# EAGLE schematic controller_board (EAGLE 9.3.0)
Assembly variants: Minimal, FullAwesome
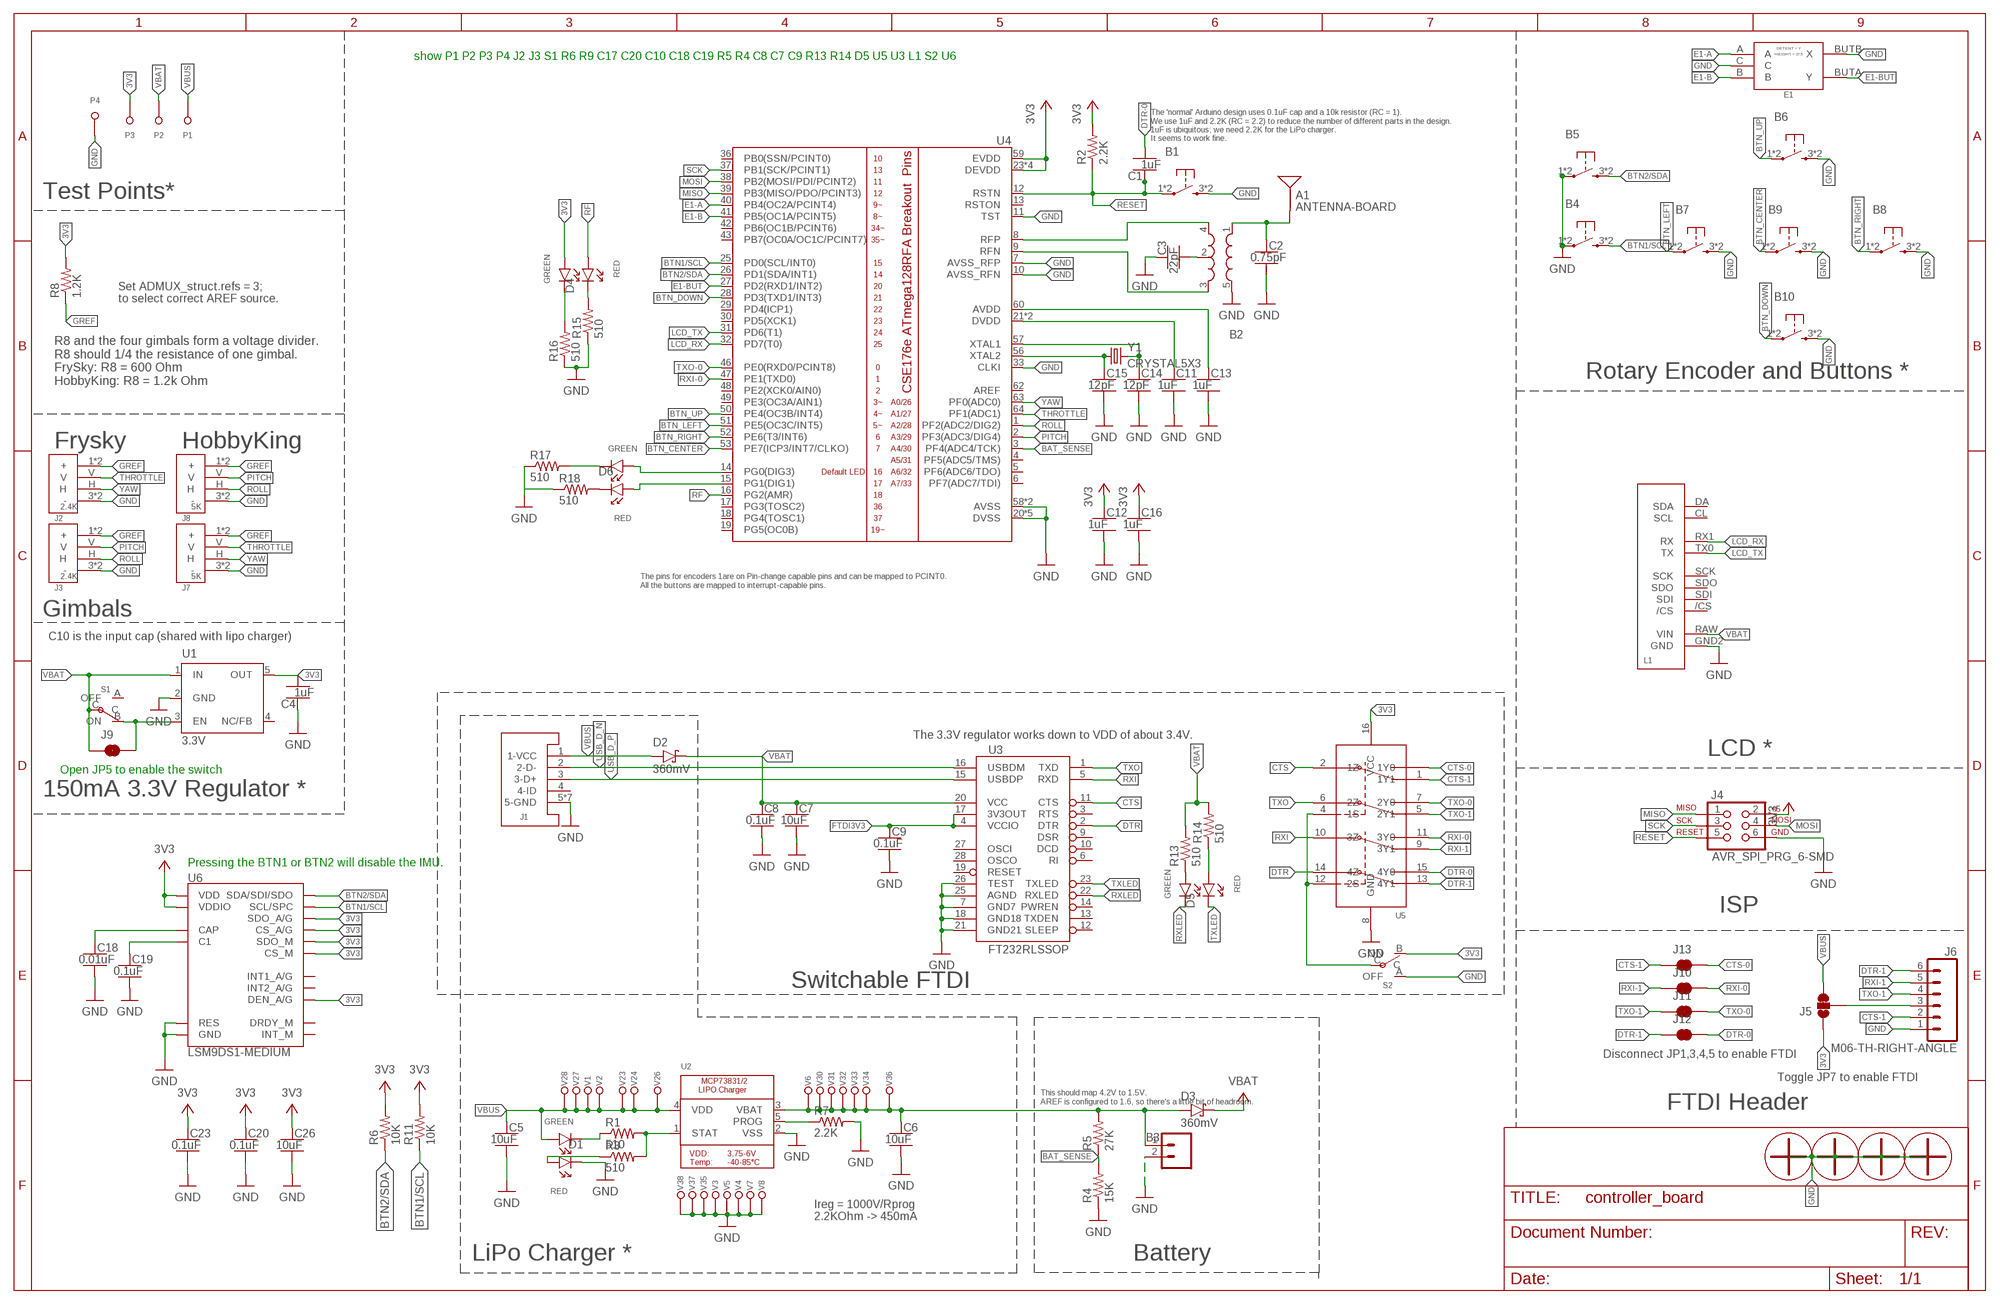
[diagram p0: schematic, sheet 1]
FRAME1 (FRAME_B_L): CREATOR: Unknown; DIST: Unknown; DISTPN: Unknown

## Parts
A1  ANTENNA-BOARD  [ANT_PCB_2.4GHZ_NRF8001_1.6MM_1OZ]
B1  PUSHBUTTON_-4.5X4.5  [4.5MM_TACTILE_SWITCH_TL3305AF160QG]
B2  BALUN0805  [BALUN]
B3  HEADER-0.1IN-2POS-SCREW  [SCREW-TERMINAL-1X2-2.54MM]
B4  PUSHBUTTON_-4.5X4.5  [4.5MM_TACTILE_SWITCH_TL3305AF160QG]  (not fitted in variant Minimal)
B5  PUSHBUTTON_-4.5X4.5  [4.5MM_TACTILE_SWITCH_TL3305AF160QG]  (not fitted in variant Minimal)
B6  PUSHBUTTON_-4.5X4.5  [4.5MM_TACTILE_SWITCH_TL3305AF160QG]
B7  PUSHBUTTON_-4.5X4.5  [4.5MM_TACTILE_SWITCH_TL3305AF160QG]
B8  PUSHBUTTON_-4.5X4.5  [4.5MM_TACTILE_SWITCH_TL3305AF160QG]
B9  PUSHBUTTON_-4.5X4.5  [4.5MM_TACTILE_SWITCH_TL3305AF160QG]
B10  PUSHBUTTON_-4.5X4.5  [4.5MM_TACTILE_SWITCH_TL3305AF160QG]
C1  1uF  CAPACITOR-NP_SMD-2012-0805_CERAMIC-1UF  [CAPC2012X140_HS]
C2  0.75pF  CAPACITOR-NP_SMD-2012-0805_CERAMIC-0.75PF  [CAPC2012X140_HS]
C3  22pF  CAPACITOR-NP_SMD-2012-0805_CERAMIC-22PF  [CAPC2012X140_HS]
C4  1uF  CAPACITOR-NP_SMD-2012-0805_CERAMIC-1UF  [CAPC2012X140_HS]
C5  10uF  CAPACITOR-NP_SMD-2012-0805_CERAMIC-10UF  [CAPC2012X140_HS]
C6  10uF  CAPACITOR-NP_SMD-2012-0805_CERAMIC-10UF  [CAPC2012X140_HS]
C7  10uF  CAPACITOR-NP_SMD-2012-0805_CERAMIC-10UF  [CAPC2012X140_HS]  (not fitted in variant Minimal)
C8  0.1uF  CAPACITOR-NP_SMD-2012-0805_CERAMIC-0.1UF  [CAPC2012X140_HS]  (not fitted in variant Minimal)
C9  0.1uF  CAPACITOR-NP_SMD-2012-0805_CERAMIC-0.1UF  [CAPC2012X140_HS]  (not fitted in variant Minimal)
C11  1uF  CAPACITOR-NP_SMD-2012-0805_CERAMIC-1UF  [CAPC2012X140_HS]
C12  1uF  CAPACITOR-NP_SMD-2012-0805_CERAMIC-1UF  [CAPC2012X140_HS]
C13  1uF  CAPACITOR-NP_SMD-2012-0805_CERAMIC-1UF  [CAPC2012X140_HS]
C14  12pF  CAPACITOR-NP_SMD-2012-0805_CERAMIC-12PF  [CAPC2012X140_HS]
C15  12pF  CAPACITOR-NP_SMD-2012-0805_CERAMIC-12PF  [CAPC2012X140_HS]
C16  1uF  CAPACITOR-NP_SMD-2012-0805_CERAMIC-1UF  [CAPC2012X140_HS]
C18  0.01uF  CAPACITOR-NP_SMD-2012-0805_CERAMIC-0.01UF  [CAPC2012X140_HS]
C19  0.1uF  CAPACITOR-NP_SMD-2012-0805_CERAMIC-0.1UF  [CAPC2012X140_HS]
C20  0.1uF  CAPACITOR-NP_SMD-2012-0805_CERAMIC-0.1UF  [CAPC2012X140_HS]
C23  0.1uF  CAPACITOR-NP_SMD-2012-0805_CERAMIC-0.1UF  [CAPC2012X140_HS]
C26  10uF  CAPACITOR-NP_SMD-2012-0805_CERAMIC-10UF  [CAPC2012X140_HS]
D1  LED-2X-GREEN/RED  [LED-2X-LTST-C155]
D2  360mV  DIODE-SCHOTTKY_SMD-SOD123-360MV  [SOD3716X135_HS]
D3  360mV  DIODE-SCHOTTKY_SMD-SOD123-360MV  [SOD3716X135_HS]
D4  LED-2X-GREEN/RED  [LED-2X-LTST-C155]
D5  LED-2X-GREEN/RED  [LED-2X-LTST-C155]  (not fitted in variant Minimal)
D6  LED-2X-GREEN/RED  [LED-2X-LTST-C155]
E1  ROTARY-ENCODER-W/BUTTON-BOURNS-PEC12R-4217F  [BOURNS-PEC12R]
H1  MOUNTING-HOLE-2-56-GROUNDED  [2-56-MOUNTING-HOLE]
H2  MOUNTING-HOLE-2-56-GROUNDED  [2-56-MOUNTING-HOLE]
H3  MOUNTING-HOLE-2-56-GROUNDED  [2-56-MOUNTING-HOLE]
H4  MOUNTING-HOLE-2-56-GROUNDED  [2-56-MOUNTING-HOLE]
J1  USB-MICROA-AMPHENOL-10118192-0001LF  [USB-MICROA-10118192-0001LF]  (not fitted in variant Minimal)
J2  2.4K  FRSKY-GIMBAL-FRYSKY  [JST-13-PTH]  (not fitted in variant Minimal)
J3  2.4K  FRSKY-GIMBAL-FRYSKY  [JST-13-PTH]  (not fitted in variant Minimal)
J4  AVR_SPI_PRG_6-SMD  [2X3-SMD]
J5  JUMPER-SMT_3_1-NC_TRACE_NO-SILK  [SMT-JUMPER_3_1-NC_TRACE_NO-SILK]
J6  M06-TH-RIGHT-ANGLE  [1X06-SIP-RIGHT-ANGLE]
J7  5K  FRSKY-GIMBAL-2X-SERVO  [2X-GIMBAL-SERVO]
J8  5K  FRSKY-GIMBAL-2X-SERVO  [2X-GIMBAL-SERVO]
J9  JUMPER-SMT_2_NC_TRACE_NO-SILK  [SMT-JUMPER_2_NC_TRACE_NO-SILK]  (not fitted in variant FullAwesome)
J10  JUMPER-SMT_2_NC_TRACE_NO-SILK  [SMT-JUMPER_2_NC_TRACE_NO-SILK]  (not fitted in variant FullAwesome)
J11  JUMPER-SMT_2_NC_TRACE_NO-SILK  [SMT-JUMPER_2_NC_TRACE_NO-SILK]  (not fitted in variant FullAwesome)
J12  JUMPER-SMT_2_NC_TRACE_NO-SILK  [SMT-JUMPER_2_NC_TRACE_NO-SILK]  (not fitted in variant FullAwesome)
J13  JUMPER-SMT_2_NC_TRACE_NO-SILK  [SMT-JUMPER_2_NC_TRACE_NO-SILK]  (not fitted in variant FullAwesome)
L1  SPARKFUN_SERLCD_SERIAL_REDUCED  [SPARKFUN_SERLCD_16X2_REDUCED]
P1  TEST-POINT  [TEST-POINT-KEYSTONE-5000]  (not fitted in variant Minimal)
P2  TEST-POINT  [TEST-POINT-KEYSTONE-5000]  (not fitted in variant Minimal)
P3  TEST-POINT  [TEST-POINT-KEYSTONE-5000]  (not fitted in variant Minimal)
P4  TEST-POINT  [TEST-POINT-KEYSTONE-5000]  (not fitted in variant Minimal)
R1  510  RESISTOR_SMD-2012-0805-510  [RESC2012X60_HS]
R2  2.2K  RESISTOR_SMD-2012-0805-2.2K  [RESC2012X60_HS]
R3  510  RESISTOR_SMD-2012-0805-510  [RESC2012X60_HS]
R4  15K  RESISTOR_SMD-2012-0805-15K  [RESC2012X60_HS]  (not fitted in variant Minimal)
R5  27K  RESISTOR_SMD-2012-0805-27K  [RESC2012X60_HS]  (not fitted in variant Minimal)
R6  10K  RESISTOR_SMD-2012-0805-10K  [RESC2012X60_HS]
R7  2.2K  RESISTOR_SMD-2012-0805-2.2K  [RESC2012X60_HS]
R8  1.2K  RESISTOR_SMD-2012-0805-1.2K  [RESC2012X60_HS]  (not fitted in variant Minimal)
R11  10K  RESISTOR_SMD-2012-0805-10K  [RESC2012X60_HS]
R13  510  RESISTOR_SMD-2012-0805-510  [RESC2012X60_HS]  (not fitted in variant Minimal)
R14  510  RESISTOR_SMD-2012-0805-510  [RESC2012X60_HS]
R15  510  RESISTOR_SMD-2012-0805-510  [RESC2012X60_HS]
R16  510  RESISTOR_SMD-2012-0805-510  [RESC2012X60_HS]
R17  510  RESISTOR_SMD-2012-0805-510  [RESC2012X60_HS]
R18  510  RESISTOR_SMD-2012-0805-510  [RESC2012X60_HS]
S1  POWER-SWITCH-MFS201N-9-ZJS102011SAQN  [JS102011SAQN]  (not fitted in variant Minimal)
S2  POWER-SWITCH-MFS201N-9-ZJS102011SAQN  [JS102011SAQN]  (not fitted in variant Minimal)
U1  3.3V  TPS73633-DBVT3V3  [SOT23-DBV]
U2  MCP73831T-2ACI/OT  MCP73831/2  [SOT23-5]
U3  FT232RLSSOP  [SSOP28DB]  (not fitted in variant Minimal)
U4  ATMEGA128RFA1  [QFN-64]
U5  DPDT-X2  [SOP65P640X110-16]  (not fitted in variant Minimal)
U6  LSM9DS1-MEDIUM  [NEW_IMU_MEDIUM]
V1  LOCKED-VIA-0.2  [VIA-0.2MM]
V2  LOCKED-VIA-0.2  [VIA-0.2MM]
V3  LOCKED-VIA-0.2  [VIA-0.2MM]
V4  LOCKED-VIA-0.2  [VIA-0.2MM]
V5  LOCKED-VIA-0.2  [VIA-0.2MM]
V6  LOCKED-VIA-0.2  [VIA-0.2MM]
V7  LOCKED-VIA-0.2  [VIA-0.2MM]
V8  LOCKED-VIA-0.2  [VIA-0.2MM]
V23  LOCKED-VIA-0.2  [VIA-0.2MM]
V24  LOCKED-VIA-0.2  [VIA-0.2MM]
V26  LOCKED-VIA-0.2  [VIA-0.2MM]
V27  LOCKED-VIA-0.2  [VIA-0.2MM]
V28  LOCKED-VIA-0.2  [VIA-0.2MM]
V30  LOCKED-VIA-0.2  [VIA-0.2MM]
V31  LOCKED-VIA-0.2  [VIA-0.2MM]
V32  LOCKED-VIA-0.2  [VIA-0.2MM]
V33  LOCKED-VIA-0.2  [VIA-0.2MM]
V34  LOCKED-VIA-0.2  [VIA-0.2MM]
V35  LOCKED-VIA-0.2  [VIA-0.2MM]
V36  LOCKED-VIA-0.2  [VIA-0.2MM]
V37  LOCKED-VIA-0.2  [VIA-0.2MM]
V38  LOCKED-VIA-0.2  [VIA-0.2MM]
Y1  CRYSTAL5X3  [CRYSTAL-SMD-5X3]

## Nets
3V3 [HIGH-I]: C4.2 C12.1 C16.1 C20.1 C23.1 C26.1 D4.A2 J4.2 J5.1 P3.T R2.2 R6.2 R8.2 R11.2 S2.B(ON) U1.5(OUT) U4.23(DEVDD) U4.34(DEVDD) U4.44(DEVDD) U4.54(DEVDD) U4.59(EVDD) U5.16(VCC) U6.CS_A/G U6.CS_M U6.DEN_A/G U6.SDO_A/G U6.SDO_M U6.VDD1(VDD) U6.VDD2(VDD) U6.VDDIO U6.VDDIO2(VDDIO)
ANTENNA [RFSIG]: A1.FEED(SIGNAL) B2.1(IN) C2.1
BAT_SENSE: R4.2 R5.1 U4.3(PF4(ADC4/TCK))
BCAP [HIGH-I]: B2.2(GND) C3.2
BPOS [HIGH-I]: B3.1 C6.1 D3.A R5.2 U2.3(VBAT) V6.P1(N) V30.P1(N) V31.P1(N) V32.P1(N) V33.P1(N) V34.P1(N) V36.P1(N)
BTN1/SCL: B4.3 B4.4 R11.1 U4.25(PD0(SCL/INT0)) U6.SCL/SPC
BTN2/SDA: B5.3 B5.4 R6.1 U4.26(PD1(SDA/INT1)) U6.SDA/SDI/SDO
BTN_CENTER: B9.1 B9.2 U4.53(PE7(ICP3/INT7/CLKO))
BTN_DOWN: B10.1 B10.2 U4.28(PD3(TXD1/INT3))
BTN_LEFT: B7.1 B7.2 U4.51(PE5(OC3C/INT5))
BTN_RIGHT: B8.1 B8.2 U4.52(PE6(T3/INT6))
BTN_UP: B6.1 B6.2 U4.50(PE4(OC3B/INT4))
CLK_NEG: C15.1 U4.56(XTAL2) Y1.1
CLK_POS: C14.1 U4.57(XTAL1) Y1.3
CTS: U3.11(CTS) U5.2(1Z)
CTS-0: J13.2 U5.3(1Y0)
CTS-1: J6.2 J13.1 U5.1(1Y1)
DTR: U3.2(DTR) U5.14(4Z)
DTR-0: C1.2 J12.2 U5.15(4Y0)
DTR-1: J6.6 J12.1 U5.13(4Y1)
E1-A: E1.A U4.40(PB4(OC2A/PCINT4))
E1-B: E1.B U4.41(PB5(OC1A/PCINT5))
E1-BUT: E1.BUTA(Y) U4.27(PD2(RXD1/INT2))
FTDI3V3 [HIGH-I]: C9.1 U3.4(VCCIO) U3.17(3V3OUT)
FTDI_VDD [HIGH-I]: J5.2 J6.3
GND [HIGH-I]: B1.3 B1.4 B2.5(GND) B3.2 B4.1 B4.2 B5.1 B5.2 B6.3 B6.4 B7.3 B7.4 B8.3 B8.4 B9.3 B9.4 B10.3 B10.4 C2.2 C3.1 C4.1 C5.2 C6.2 C7.2 C8.2 C9.2 C11.2 C12.2 C13.2 C14.2 C15.2 C16.2 C18.2 C19.2 C20.2 C23.2 C26.2 D1.C1 E1.BUTB(X) E1.C H1.1(P) H1.2(P) H1.3(P) H1.4(P) H1.5(P) H1.6(P) H1.7(P) H1.8(P) H2.1(P) H2.2(P) H2.3(P) H2.4(P) H2.5(P) H2.6(P) H2.7(P) H2.8(P) H3.1(P) H3.2(P) H3.3(P) H3.4(P) H3.5(P) H3.6(P) H3.7(P) H3.8(P) H4.1(P) H4.2(P) H4.3(P) H4.4(P) H4.5(P) H4.6(P) H4.7(P) H4.8(P) J1.5(5-GND) J1.6(5-GND) J1.7(5-GND) J1.8(5-GND) J1.9(5-GND) J1.10(5-GND) J1.11(5-GND) J2.3(-) J2.6(-) J3.3(-) J3.6(-) J4.6 J6.1 J7.3(-) J7.6(-) J8.3(-) J8.6(-) L1.GND2(GND) P4.T R4.1 R7.2 R15.1 R16.1 R17.1 R18.1 S2.A(OFF) U1.2(GND) U2.2(VSS) U3.7(GND7) U3.18(GND18) U3.21(GND21) U3.25(AGND) U3.26(TEST) U4.7(AVSS_RFP) U4.10(AVSS_RFN) U4.11(TST) U4.20(DVSS) U4.24(DVSS) U4.33(CLKI) U4.35(DVSS) U4.45(DVSS) U4.55(DVSS) U4.58(AVSS) U4.61(AVSS) U5.8(GND) U6.GND1(GND) U6.GND2(GND) U6.RES1(RES) U6.RES2(RES) U6.RES3(RES) U6.RES4(RES) U6.RES5(RES) V3.P1(N) V4.P1(N) V5.P1(N) V7.P1(N) V8.P1(N) V35.P1(N) V37.P1(N) V38.P1(N)
GREF: J2.1(+) J2.4(+) J3.1(+) J3.4(+) J7.1(+) J7.4(+) J8.1(+) J8.4(+) R8.1
LCD_RX: L1.RX1(RX) U4.32(PD7(T0))
LCD_TX: L1.TX0(TX) U4.31(PD6(T1))
MISO: J4.1 U4.39(PB3(MISO/PDO/PCINT3))
MOSI: J4.4 U4.38(PB2(MOSI/PDI/PCINT2))
N$1: D1.A1 R3.1
N$2: D1.C2 R1.1
N$3: D5.A1 R14.1
N$4: D6.C2 R17.2
N$5: C18.1 U6.CAP
N$6: D4.C1 R15.2
N$7: C19.1 U6.C1
N$8: D6.A2 U4.14(PG0(DIG3))
N$9: D6.A1 U4.15(PG1(DIG1))
N$11: R1.2 R3.2 U2.1(STAT)
N$12: R7.1 U2.5(PROG)
N$13: D4.C2 R16.2
N$14: D5.A2 R13.1
N$16: J9.2 S1.B(ON) U1.3(EN)
N$20: C11.1 U4.21(DVDD) U4.22(DVDD)
N$21: C13.1 U4.60(AVDD)
N$30: D6.C1 R18.2
PITCH: J3.V J8.V U4.2(PF3(ADC3/DIG4))
PROG_SEL: S2.C U5.4(1S) U5.12(2S)
RESET: B1.1 B1.2 C1.1 J4.5 R2.1 U4.12(RSTN)
RF: D4.A1 U4.16(PG2(AMR))
RFN: B2.3(OUT2) U4.9(RFN)
RFP: B2.4(OUT1) U4.8(RFP)
ROLL: J3.H J8.H U4.1(PF2(ADC2/DIG2))
RXI: U3.5(RXD) U5.10(3Z)
RXI-0: J10.2 U4.47(PE1(TXD0)) U5.11(3Y0)
RXI-1: J6.5 J10.1 U5.9(3Y1)
RXLED: D5.C2 U3.22(RXLED)
SCK: J4.3 U4.37(PB1(SCK/PCINT1))
THROTTLE: J2.V J7.V U4.64(PF1(ADC1))
TXLED: D5.C1 U3.23(TXLED)
TXO: U3.1(TXD) U5.6(2Z)
TXO-0: J11.2 U4.46(PE0(RXD0/PCINT8)) U5.7(2Y0)
TXO-1: J6.4 J11.1 U5.5(2Y1)
USB_D_N: J1.2(2-D-) U3.16(USBDM)
USB_D_P: J1.3(3-D+) U3.15(USBDP)
VBAT [HIGH-I]: C7.1 C8.1 D2.C D3.C J9.1 L1.RAW(VIN) P2.T R13.2 R14.2 S1.C U1.1(IN) U3.20(VCC)
VBUS [HIGH-I]: C5.1 D1.A2 D2.A J1.1(1-VCC) J5.3 P1.T U2.4(VDD) V1.P1(N) V2.P1(N) V23.P1(N) V24.P1(N) V26.P1(N) V27.P1(N) V28.P1(N)
YAW: J2.H J7.H U4.63(PF0(ADC0))
Unconnected: J1.4(4-ID) L1./CS L1.CL(SCL) L1.DA(SDA) L1.SCK L1.SDI L1.SDO S1.A(OFF) U1.4(NC/FB) U3.3(RTS) U3.6(RI) U3.9(DSR) U3.10(DCD) U3.12(SLEEP) U3.13(TXDEN) U3.14(PWREN) U3.19(RESET) U3.27(OSCI) U3.28(OSCO) U4.4(PF5(ADC5/TMS)) U4.5(PF6(ADC6/TDO)) U4.6(PF7(ADC7/TDI)) U4.13(RSTON) U4.17(PG3(TOSC2)) U4.18(PG4(TOSC1)) U4.19(PG5(OC0B)) U4.29(PD4(ICP1)) U4.30(PD5(XCK1)) U4.36(PB0(SSN/PCINT0)) U4.42(PB6(OC1B/PCINT6)) U4.43(PB7(OC0A/OC1C/PCINT7)) U4.48(PE2(XCK0/AIN0)) U4.49(PE3(OC3A/AIN1)) U4.62(AREF) U6.DRDY_M U6.INT1_A/G U6.INT2_A/G U6.INT_M

## Notes on the sheet
- show P1 P2 P3 P4 J2 J3 S1 R6 R9 C17 C20 C10 C18 C19 R5 R4 C8 C7 C9 R13 R14 D5 U5 U3 L1 S2 U6
- The 'normal' Arduino design uses 0.1uF cap and a 10k resistor (RC = 1).
  We use 1uF and 2.2K (RC = 2.2) to reduce the number of different parts in the design.
  1uF is ubiquitous; we need 2.2K for the LiPo charger.  
  It seems to work fine.
- Test Points*
- Set ADMUX_struct.refs = 3;
  to select correct AREF source.
- Rotary Encoder and Buttons *
- R8 and the four gimbals form a voltage divider.
  R8 should 1/4 the resistance of one gimbal.
  FrySky: R8 = 600 Ohm
  HobbyKing: R8 = 1.2k Ohm
- Frysky | HobbyKing
- The pins for encoders 1are on Pin-change capable pins and can be mapped to PCINT0.
  All the buttons are mapped to interrupt-capable pins.
- Gimbals
- C10 is the input cap (shared with lipo charger)
- The 3.3V regulator works down to VDD of about 3.4V.
- LCD *
- Open JP5 to enable the switch
- 150mA 3.3V Regulator *
- Pressing the BTN1 or BTN2 will disable the IMU.
- ISP
- Switchable FTDI
- Disconnect JP1,3,4,5 to enable FTDI
- Toggle JP7 to enable FTDI
- This should map 4.2V to 1.5V.
  AREF is configured to 1.6, so there's a little bit of headroom.
- FTDI Header
- Ireg = 1000V/Rprog
  2.2KOhm -> 450mA
- LiPo Charger * | Battery

## Library data of the parts
A1 = quadparts_prebuilt:ANTENNA: Single endded antenna.; CREATOR: Swanson; DIST: NA; DISTPN: NA; MOUNTING: NONE
B1 B4-B10 = quadparts_prebuilt:PUSHBUTTON_: "Tactile" or "clicky" button.; CREATOR: Swanson; DIST: DIGIKEY; DISTPN: EG5350CT-ND; MOUNTING: SMD
B2 = quadparts_prebuilt:BALUN: A balun to convert differential radio-frequency outputs from the microcontroller into a single-ended driver for the antenna.; CREATOR: Swanson; DATASHEET: http://katalog.we-online.de/pbs/datasheet/748421245.pdf; DIST: Digikey; DISTPN: 732-2230-6-ND; MFR: Wurth Electronics Inc; MOUNTING: SMD; MPN: 748421245; PRICE: 2.63; REVIEWER: Swanson
B3 = RemoteParts:HEADER-0.1IN-2POS: 2 pin single inline pin header, socket, or connector; CREATOR: Swanson; DIST: digikey; DISTPN: ED10561-ND; MOUNTING: TH; PIN1: +; PIN2: -
C1 C4 C11-C13 C16 = quadparts_prebuilt:CAPACITOR-NP_: Nonpolarized capacitor; CREATOR: Swanson; DIST: Digikey; DISTPN: 587-1281-1-ND; MFR: Taiyo Yuden; MOUNTING: SMD; MPN: TMK212B7105KG-T; REVIEWER: Swanson
C2 = quadparts_prebuilt:CAPACITOR-NP_: Nonpolarized capacitor; CREATOR: Swanson; DIST: Digikey; DISTPN: 490-3585-1-ND; MFR: Murata Electronics North America; MOUNTING: SMD; MPN: GQM2195C2AR75CB01D; REVIEWER: Swanson
C3 = quadparts_prebuilt:CAPACITOR-NP_: Nonpolarized capacitor; CREATOR: Swanson; DIST: Digikey; DISTPN: 490-5534-1-ND; MFR: Murata Electronics North America; MOUNTING: SMD; MPN: GRM21A5C2E220JW01D; REVIEWER: Swanson
C5-C7 C26 = quadparts_prebuilt:CAPACITOR-NP_: Nonpolarized capacitor; CREATOR: Swanson; DIST: Digikey; DISTPN: 445-5984-1-ND; MOUNTING: SMD; REVIEWER: Swanson
C8 C9 C19 C20 C23 = quadparts_prebuilt:CAPACITOR-NP_: Nonpolarized capacitor; CREATOR: Swanson; DIST: Digikey; DISTPN: 445-1418-1-ND; MFR: TDK; MOUNTING: SMD; MPN: C2012X7R2A104K125AA; REVIEWER: Swanson
C14 C15 = quadparts_prebuilt:CAPACITOR-NP_: Nonpolarized capacitor; CREATOR: Swanson; DIST: Digikey; DISTPN: 490-5531-1-ND; MFR: Murata Electronics North America; MOUNTING: SMD; MPN: GRM21A5C2E120JW01D; REVIEWER: Swanson
C18 = quadparts_prebuilt:CAPACITOR-NP_: Nonpolarized capacitor; CREATOR: Swanson; DIST: Digikey; DISTPN: 1608-1458-1-ND; MFR: Knowles Syfer; MOUNTING: SMD; MPN: 0805J0500104KJT; REVIEWER: Swanson
D1 D4-D6 = RemoteParts:LED-2X; COLOR1: GREEN; COLOR2: RED; CREATOR: Swanson; DIST: DIGIKEY; DISTPN: 160-1172-1-ND; MOUNTING: SMD
D2 D3 = quadparts_prebuilt:DIODE-SCHOTTKY_: Schottky diode; CREATOR: Swanson; DIST: Digikey; DISTPN: CRS08QMCT-ND; MFR: Toshiba Semiconductor and Storage; MOUNTING: SMD; MPN: CRS08(TE85L,Q,M); REVIEWER: Swanson
E1 = RemoteParts:ROTARY-ENCODER-W/BUTTON; AUX1DIST: DIGIKEY; AUX1DISTPN: 1722-1241-ND; CREATOR: Swanson; DETENT: Y; DIST: DIGIKEY; DISTPN: PEC12R-4217F-S0024-ND; HEIGHT: 17.5; MOUNTING: TH
H1-H4 = RemoteParts:MOUNTING-HOLE; CREATOR: Swanson; DIST: NA; DISTPN: NA; MOUNTING: NONE
J1 = RemoteParts:USB; CREATOR: Swanson; DIST: DIGIKEY; DISTPN: 609-4613-1-ND; MOUNTING: SMD
J2 = RemoteParts:FRSKY-GIMBAL; CREATOR: Swanson; DIST: Digikey; DISTPN: A100106-ND; MOUNTING: TH
J3 = RemoteParts:FRSKY-GIMBAL; CREATOR: Swanson; DIST: Digikey; DISTPN: A100106-ND; MOUNTING: TH; SPICEPREFIX: E
J4 = quadparts_prebuilt:AVR_SPI_PRG_6: AVR ISP 6 Pin This is the in-system programming (ISP) connector for Atmel Microcontrollers programming.; CREATOR: Swanson; DIST: Digikey; DISTPN: 952-1922-ND; MOUNTING: SMD
J5 = RemoteParts:JUMPER-SMT_3_1-NC_TRACE: Normally closed trace jumper (1 of 2 connections) This jumper has a trace between two pads so it's normally closed (NC). The other connection is normally open (NO). Use a razor knife to open the connection. For best results follow the IPC guidelines for cutting traces: Cutout at least 0.063 mm (0.005 in). Remove all loose material to clean up the cut area. Seal the cut with an approved epoxy. Reapply solder to reclose the connection, or to close the NO connection.; CREATOR: Sparkfun; DIST: NA; DISTPN: NA; MOUNTING: NONE
J6 = RemoteParts:M06: Header 6 Standard 6-pin 0.1in header. Use with straight break away headers (SKU : PRT-00116), right angle break away headers (PRT-00553), swiss pins (PRT-00743), machine pins (PRT-00117), and female headers (PRT-00115). Molex polarized connector foot print use with SKU : PRT-08094 with associated crimp pins and housings. NOTES ON THE VARIANTS LOCK and LOCK_LONGPADS... This footprint was designed to help hold the alignment of a through-hole component (i.e. 6-pin header) while soldering it into place. You may notice that each hole has been shifted either up or down by 0.005 of an inch from it's more standard position (which is a perfectly straight line). This slight alteration caused the pins (the squares in the middle) to touch the edges of the holes. Because they are alternating, it causes a "brace" to hold the component in place. 0.005 has proven to be the perfect amount of "off-center" position when using our standard breakaway headers. Although looks a little odd when you look at the bare footprint, once you have a header in there, the alteration is very hard to notice. Also, if you push a header all the way into place, it is covered up entirely on the bottom side. This idea of altering the position of holes to aid alignment will be further integrated into the Sparkfun Library for other footprints. It can help hold any component with 3 or more connection pins.; CREATOR: Swanson; DIST: DIGIKEY; DISTPN: 609-3327-ND; MOUNTING: TH
J7 J8 = RemoteParts:FRSKY-GIMBAL; CREATOR: Swanson; DIST: DIGIKEY; DISTPN: 609-3327-ND; MOUNTING: TH
J9-J13 = RemoteParts:JUMPER-SMT_2_NC_TRACE: Normally closed trace jumper This jumper has a trace between two pads so it's normally closed (NC). Use a razor knife to open the connection. For best results follow the IPC guidelines for cutting traces: Cutout at least 0.063 mm (0.005 in). Remove all loose material to clean up the cut area. Seal the cut with an approved epoxy. Reapply solder to reclose the connection.; CREATOR: Sparkfun; DIST: NA; DISTPN: NA; MOUNTING: NONE
L1 = RemoteParts:SPARKFUN_SERLCD_SERIAL_REDUCED; AUX1DIST: DIGIKEY; AUX1DISTPN: 952-1842-ND; AUX2DIST: Digikey; AUX2DISTPN: S7008-ND; CREATOR: Swanson; DIST: Sparkfun; DISTPN: LCD-14072
P1-P4 = RemoteParts:TEST-POINT; CREATOR: Swanson; DIST: DIGIKEY; DISTPN: 36-5001-ND; MOUNTING: TH
R1 R3 R13-R18 = quadparts_prebuilt:RESISTOR_: Resistor; CREATOR: SWANSON; DIST: DIGIKEY; DISTPN: 311-510ARCT-ND; MOUNTING: SMD
R2 R7 = quadparts_prebuilt:RESISTOR_: Resistor; CREATOR: SWANSON; DIST: DIGIKEY; DISTPN: YAG3776CT-ND; MOUNTING: SMD
R4 = quadparts_prebuilt:RESISTOR_: Resistor; CREATOR: SWANSON; DIST: DIGIKEY; DISTPN: YAG3695CT-ND; MOUNTING: SMD
R5 = quadparts_prebuilt:RESISTOR_: Resistor; CREATOR: Swanson; DIST: DIGIKEY; DISTPN: 311-27.0KCRCT-ND; MOUNTING: SMD
R6 R11 = quadparts_prebuilt:RESISTOR_: Resistor; CREATOR: Swanson; DIST: Digikey; DISTPN: 311-10KARCT-ND; MFR: Yageo; MOUNTING: SMD; MPN: RC0805JR-0710KL; REVIEWER: Swanson
R8 = quadparts_prebuilt:RESISTOR_: Resistor; CREATOR: Swanson; DIST: DIGIKEY; DISTPN: 311-1.20KARCT-ND; MOUNTING: SMD
S1 S2 = RemoteParts:POWER-SWITCH-MFS201N-9-Z; CREATOR: Swanson; DIST: DIGIKEY; DISTPN: 401-1999-1-ND; MOUNTING: SMD
U1 = quadparts_prebuilt:TPS73633-DBVT: LP3985-series voltage regulators.; CREATOR: Swanson; DIST: DIGIKEY; DISTPN: LP3985IM5-3.3/NOPBCT-ND; MOUNTING: SMD
U2 = RemoteParts:MCP73831/2: MCP73831/2 LIPO Charger VDD: 3.75 - 6V Temp -40 - 85°C Programmable Charge Rate: 15-500mA NOTE: STAT is a tri-state logic output on the MCP73831 and an open-drain output on the MCP73832. SOT23-5 with 4.2V output and tri-state logic on STAT = MCP73831T-2ACI/OT; CREATOR: Adafruit; DIST: DIGIKEY; DISTPN: MCP73831T-2ACI/OTCT-ND; MOUNTING: SMD
U3 = RemoteParts:FT232RL: USB UART FT232RL 4th Generation USB UART (USB <-> Serial) Controller. Spark Fun Electronics SKU : COM-00650; CREATOR: Swanson; DIST: DIGIKEY; DISTPN: 768-1007-1-ND; MOUNTING: SMD
U4 = quadparts_prebuilt:ATMEGA128RFA1: ATmega128RFA1 8-bit AVR Microcontroller with Low Power 2.4GHz Transceiver for ZigBee and IEEE 802.15.4; CREATOR: Swanson; DATASHEET: http://www.atmel.com/Images/Atmel-8266-MCU_Wireless-ATmega128RFA1_Datasheet.pdf; DIST: Digikey; DISTPN: ATMEGA128RFA1-ZU-ND; MFR: Atmel; MOUNTING: SMD; MPN: ATMEGA128RFA1-ZUR00; PRICE: 10.21; REVIEWER: Swanson
U5 = RemoteParts:DPDT-X2; CREATOR: Swanson; DIST: DIGIKEY; DISTPN: 568-5300-1-ND; MOUNTING: SMD
U6 = IMUs:LSM9DS1: LSM9DS1 3D accelerometer, gyroscope & magnetometer The LSM9DS1 is a system-in-package featuring a 3D digital linear acceleration sensor, a 3D digital angular rate sensor, and a 3D digital magnetic sensor. The LSM9DS1 has a linear acceleration full scale of ±2g/±4g/±8/±16 g, a magnetic field full scale of ±4/±8/±12/±16 gauss and an angular rate of ±245/±500/±2000 dps. The LSM9DS1 includes an I2 C serial bus interface supporting standard and fast mode (100 kHz and 400 kHz) and an SPI serial standard interface. Magnetic, accelerometer and gyroscope sensing can be enabled or set in power-down mode separately for smart power management. The LSM9DS1 is available in a plastic land grid array package (LGA) and it is guaranteed to operate over an extended temperature range from -40 °C to +85 °C.; CREATOR: PBROWN; DIST: Digikey; DISTPN: 497-14946-1-ND
V1-V8 V23 V24 V26-V28 V30-V38 = quadparts_prebuilt:LOCKED-VIA: A via that be removed via ripup.; CREATOR: Swanson; DIST: NA; DISTPN: NA; MOUNTING: NONE
Y1 = quadparts_prebuilt:CRYSTAL: Crystals to provide clock references for microcontrollers, etc.; CREATOR: Swanson; DATASHEET: http://www.abracon.com/Resonators/abm3b.pdf; DIST: Digikey; DISTPN: 535-9122-1-ND; MFR: Abracon LLC; MOUNTING: SMD; MPN: ABM3B-16.000MHZ-B2-T; PRICE: 0.68; PROD_ID: XTAL-08218; REVIEWER: Swanson

## Net classes
1 HIGH-I: width 0.178 mm
2 RFSIG: width 1.27 mm
3 pwr: width 0.254 mm